# Altium project e-BTW.PrjPcb
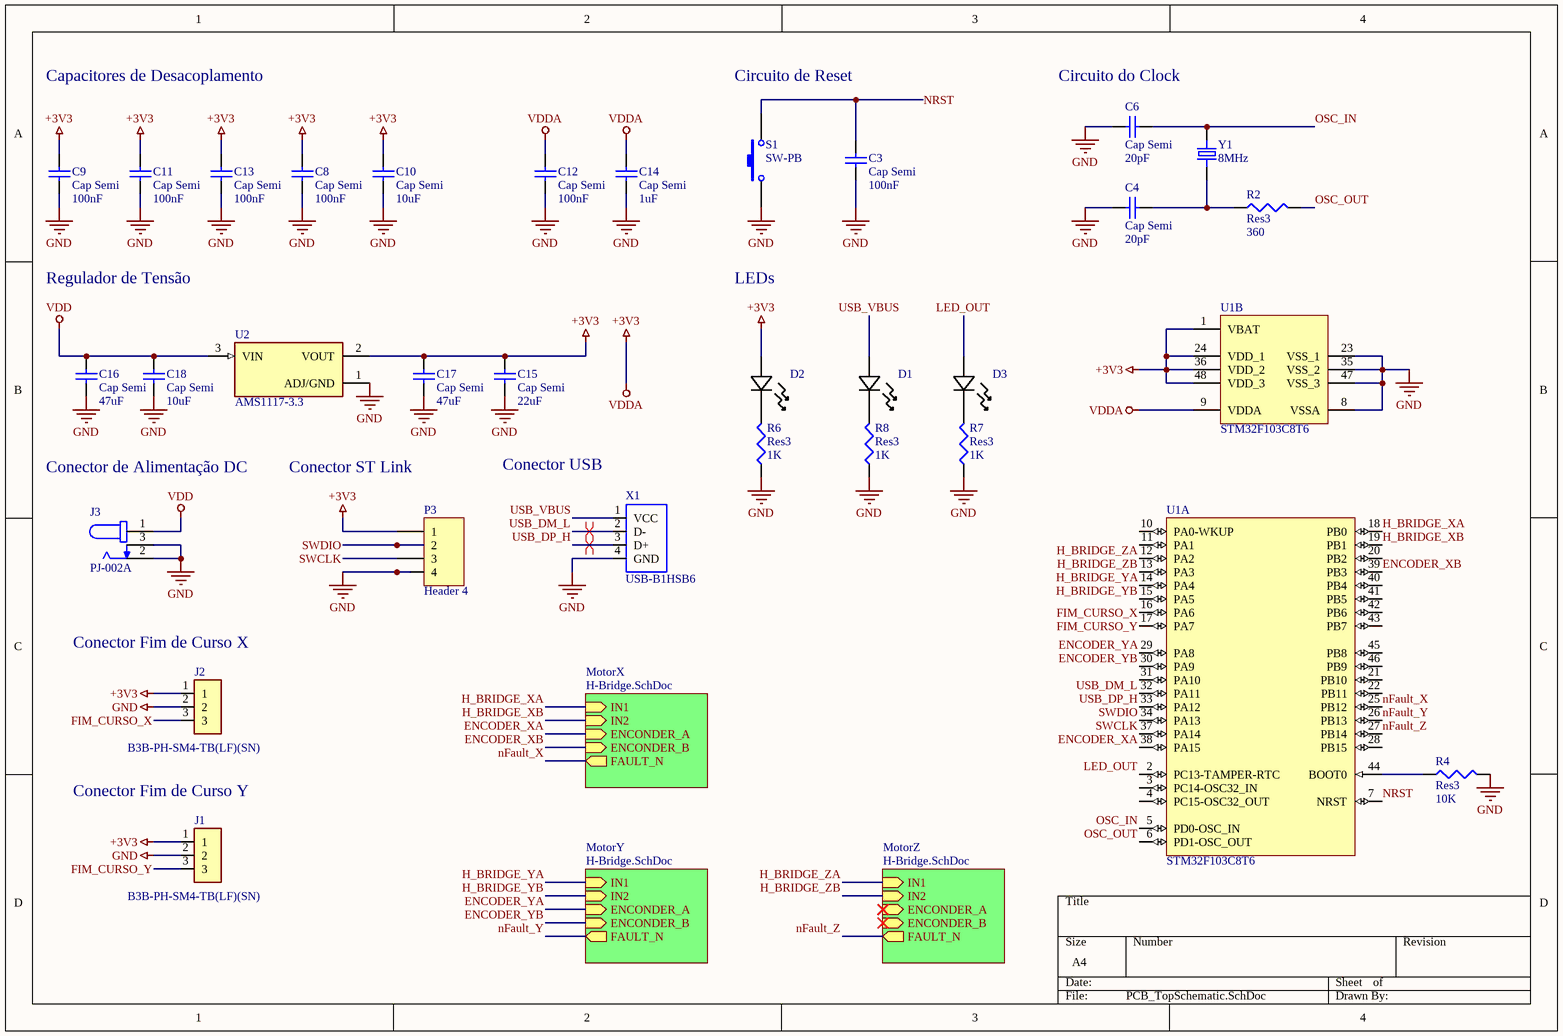
[diagram p0: PCB_TopSchematic.SchDoc]
2 sheets, 46 parts. Net scope: hierarchical (ports join the sheet entries above them; power ports are global).
Board file: PCB1.PcbDoc
Sheets:
  PCB_TopSchematic.SchDoc
    MotorX = H-Bridge.SchDoc
    MotorY = H-Bridge.SchDoc
    MotorZ = H-Bridge.SchDoc

## Sheet PCB_TopSchematic.SchDoc
size A4

### Parts
C3  Cap Semi  value 100nF  [1608[0603]]
C4  Cap Semi  value 20pF  [1608[0603]]
C6  Cap Semi  value 20pF  [1608[0603]]
C8  Cap Semi  value 100nF  [1608[0603]]
C9  Cap Semi  value 100nF  [1608[0603]]
C10  Cap Semi  value 10uF  [1608[0603]]
C11  Cap Semi  value 100nF  [1608[0603]]
C12  Cap Semi  value 100nF  [1608[0603]]
C13  Cap Semi  value 100nF  [1608[0603]]
C14  Cap Semi  value 1uF  [1608[0603]]
C15  Cap Semi  value 22uF  [1608[0603]]
C16  Cap Semi  value 47uF  [1608[0603]]
C17  Cap Semi  value 47uF  [1608[0603]]
C18  Cap Semi  value 10uF  [1608[0603]]
D1  SML-E12M8WT86  [LED_SMLD12_ROM]  (value not drawn)
D2  SML-E12M8WT86  [LED_SMLD12_ROM]  (value not drawn)
D3  SML-E12M8WT86  [LED_SMLD12_ROM]  (value not drawn)
J1  B3B-PH-SM4-TB(LF)(SN)  [JST_B3B-PH-SM4-TB(LF)(SN)]
J2  B3B-PH-SM4-TB(LF)(SN)  [JST_B3B-PH-SM4-TB(LF)(SN)]
J3  PJ-002A  [CUI_PJ-002A]
P3  Header 4  [HDR1X4]
R2  Res3  value 360  [RESC1607X60N]
R4  Res3  value 10K  [RESC1607X60N]
R6  Res3  value 1K  [RESC1607X60N]
R7  Res3  value 1K  [RESC1607X60N]
R8  Res3  value 1K  [RESC1607X60N]
S1  SW-PB  [SW_B3FS-1010P]
U1  STM32F103C8T6  [STM-LQFP48_N]  (parts A,B of 2)
U2  AMS1117-3.3  [SOT229P700X180-4N]
X1  USB-B1HSB6  [OST_USB-B1HSB6]
Y1  8MHz  [XTAL_ECS-80-20-5PX-TR]

### Sub-sheets
MotorX = H-Bridge.SchDoc: IN1 (in), IN2 (in), FAULT_N (out), ENCONDER_A (in), ENCONDER_B (in)
MotorY = H-Bridge.SchDoc: IN1 (in), IN2 (in), FAULT_N (out), ENCONDER_A (in), ENCONDER_B (in)
MotorZ = H-Bridge.SchDoc: IN1 (in), IN2 (in), FAULT_N (out), ENCONDER_A (in), ENCONDER_B (in)

### Nets
+3V3: C8.2 C9.2 C10.2 C11.2 C12.2 C13.2 C14.2 C15.2 C17.2 D2.2 J1.1 J2.1 P3.1 U1.1(VBAT) U1.9(VDDA) U1.24(VDD_1) U1.36(VDD_2) U1.48(VDD_3) U2.2(VOUT)  [also labelled VDDA]
GND: C3.1 C4.2 C6.2 C8.1 C9.1 C10.1 C11.1 C12.1 C13.1 C14.1 C15.1 C16.1 C17.1 C18.1 J1.2 J2.2 J3.2 J3.3 P3.4 R4.2 R6.1 R7.1 R8.1 S1.1 U1.8(VSSA) U1.23(VSS_1) U1.35(VSS_2) U1.47(VSS_3) U2.1(ADJ/GND) X1.4(GND)
VDD: C16.2 C18.2 J3.1 U2.3(VIN)
ENCODER_XA: U1.38(PA15) ; sheet MotorX/ENCONDER_A
ENCODER_XB: U1.39(PB3) ; sheet MotorX/ENCONDER_B
ENCODER_YA: U1.29(PA8) ; sheet MotorY/ENCONDER_A
ENCODER_YB: U1.30(PA9) ; sheet MotorY/ENCONDER_B
FIM_CURSO_X: J2.3 U1.16(PA6)
FIM_CURSO_Y: J1.3 U1.17(PA7)
H_BRIDGE_XA: U1.18(PB0) ; sheet MotorX/IN1
H_BRIDGE_XB: U1.19(PB1) ; sheet MotorX/IN2
H_BRIDGE_YA: U1.14(PA4) ; sheet MotorY/IN1
H_BRIDGE_YB: U1.15(PA5) ; sheet MotorY/IN2
H_BRIDGE_ZA: U1.12(PA2) ; sheet MotorZ/IN1
H_BRIDGE_ZB: U1.13(PA3) ; sheet MotorZ/IN2
LED_OUT: D3.2 U1.2(PC13-TAMPER-RTC)
nFault_X: U1.25(PB12) ; sheet MotorX/FAULT_N
nFault_Y: U1.26(PB13) ; sheet MotorY/FAULT_N
nFault_Z: U1.27(PB14) ; sheet MotorZ/FAULT_N
NRST: C3.2 S1.2 U1.7(NRST)
OSC_IN: C6.1 U1.5(PD0-OSC_IN) Y1.1
OSC_OUT: R2.2 U1.6(PD1-OSC_OUT)
SWCLK: P3.3 U1.37(PA14)
SWDIO: P3.2 U1.34(PA13)
USB_DM_L: U1.32(PA11) X1.2(D-)
USB_DP_H: U1.33(PA12) X1.3(D+)
USB_VBUS: D1.2 X1.1(VCC)
NetC4_1: C4.1 R2.1 Y1.2
NetD1_1: D1.1 R8.2
NetD2_1: D2.1 R6.2
NetD3_1: D3.1 R7.2
NetR4_1: R4.1 U1.44(BOOT0)

Not connected (* = marked no-connect by the designer): U1 3(PC14-OSC32_IN) 4(PC15-OSC32_OUT) 10(PA0-WKUP) 11(PA1) 20(PB2) 21(PB10) 22(PB11) 28(PB15) 31(PA10) 40(PB4) 41(PB5) 42(PB6) 43(PB7) 45(PB8) 46(PB9)

### Notes on the sheet
- Capacitores de Desacoplamento
- Circuito de Reset
- Circuito do Clock
- Regulador de Tensão
- LEDs
- Conector de Alimentação DC
- Conector ST Link
- Conector USB
- (near J2) Conector Fim de Curso X
- Conector Fim de Curso Y

### Library data of the parts
C3 C4 C6 C8-C18 = Cap Semi: Capacitor (Semiconductor SIM Model); Published: 8-Jun-2000; LatestRevisionDate: 29-May-2009; LatestRevisionNote: IPC-7351 Footprint Added.; PackageReference: C1206; Publisher: Altium Limited; PackageDescription: Chip Capacitor
D1-D3 = SML-E12M8WT86: No Description Available; Vendor: ROHM Semiconductor; Built_By: EMA_Matt; SourceLibrary: Rohm_2019-09-23; Type: DEV; Manufacturer_Part_Number: SML-E12M8WT86; Copyright: Copyright (C) 2018 Accelerated Designs. All rights reserved; RefDes: RefDes
J1 J2 = B3B-PH-SM4-TB(LF)(SN): Connector Header Surface Mount 3 position 0.079 _2.00mm_; MF: JST Sales; MP: B3B-PH-SM4-TB_LF__SN_; Digi-Key_Part_Number: 455-1735-1-ND; Digi-Key_Purchase_URL: https://www.digikey.com/product-detail/en/jst-sales-america-inc/B3B-PH-SM4-TB_LF__SN_/455-1735-1-ND/926832?utm_source=snapeda&utm_medium=aggregator&utm_campaign=symbol; Value: *; SnapEDA_Link: https://www.snapeda.com/parts/B3B-PH-SM4-TB%28LF%29%28SN%29/JST%20Sales%20America%20Inc./view-part/53135/?ref=snap; Package: 2010 JST
J3 = PJ-002A: 2,0 x 6,5 mm, 2,5 A, Yatay, AÃ§Ä±k Delik, Dc GÃ¼Ã§ JakÄ± KonnektÃ¶rÃ¼; MF: CUI Devices; Package: None; Price: None; CUI_purchase_URL: https://www.cuidevices.com/product/interconnect/connectors/dc-power-connectors/jacks/pj-002a?utm_source=snapeda.com&utm_medium=referral&utm_campaign=snapedaBOM; SnapEDA_Link: https://www.snapeda.com/parts/PJ-002A/CUI%20Devices/view-part/287588/?ref=snap; Availability: Unavailable; Value: *; MP: PJ-002A
P3 = Header 4: Header, 4-Pin; LatestRevisionDate: 17-Jul-2002; LatestRevisionNote: Re-released for DXP Platform.; Publisher: Altium Limited
R2 R4 R6-R8 = Res3: Resistor; Published: 8-Jun-2000; LatestRevisionDate: 29-May-2009; LatestRevisionNote: IPC-7351 Footprint Added.; PackageReference: J1-0603; Publisher: Altium Limited; PackageDescription: Chip Resistor
S1 = SW-PB: Switch; Published: 24-Mar-1999; LatestRevisionDate: 17-Jul-2002; LatestRevisionNote: Re-released for DXP Platform.; PackageReference: SPST-2; Publisher: Altium Limited; PackageDescription: Switch; 2 Leads
U1 = STM32F103C8T6: ARM Cortex-M3 32-bit MCU, 64 KB Flash, 20 KB Internal RAM, 37 I/Os, 48-pin LQFP, -40 to 85 degC, Tray; A/D Converter: 2x12-bit (10 Channel); FLASH Size (Prog) (kB): 64; I/Os (High Current): 37; Internal RAM Size (kB): 20; Operating Frequency(F) (Processor speed) (MHz): 72; Supply Voltage(Vcc) min (V): 2; DatasheetVersion: Rev. 16; PackageVersion: Rev. 6, 06/2013; PackageReference: LQFP48; PackageDescription: 48-Pin Low Profile Quad Flat Package, 7 x 7 mm Body, 0.5 mm Pitch; Supplier 1: Digi-Key; Supplier Part Number 1: 497-6063-ND; Supplier 2: Farnell; Supplier Part Number 2: 1447637; Supplier 3: Newark; Supplier Part Number 3: 59M2182; Supplier 4: Newark; Supplier Part Number 4: 57P1222; Supplier 5: Mouser; Supplier Part Number 5: 511-STM32F103C8T6; Core: ARM Cortex-M3; Packing: Tray; Mounting Technology: Surface Mount; PartNumber: STM32F103C8T6; ComponentLink1Description: Manufacturer URL; ComponentLink1URL: http://www.st.com/web/en/home.html; ComponentLink2Description: Datasheet; ComponentLink2URL: http://www.st.com/st-web-ui/static/active/en/resource/technical/document/datasheet/CD00161566.pdf; ComponentLink3Description: Package Specification; ComponentLink3URL: http://www.st.com/st-web-ui/static/active/en/resource/technical/document/datasheet/DM00058181.pdf
U2 = AMS1117-3.3: Sot223/Pkg 1-Amp 3.3-Volt Low Drop Out Voltage Regulatator; MF: Advanced Monolithic Systems; Price: None; Package: None; Value: *; MP: AMS1117-3.3; Availability: Unavailable; SnapEDA_Link: https://www.snapeda.com/parts/AMS1117-3.3/Advanced%20Monolithic%20Systems/view-part/53450/?ref=snap
X1 = USB-B1HSB6: USB-B _USB TYPE-B_ Receptacle Connector 4 Position Through Hole, Right Angle; MF: On Shore; Value: *; SnapEDA_Link: https://www.snapeda.com/parts/USB-B1HSB6/On%20Shore%20Technology%20Inc./view-part/227661/?ref=snap; Digi-Key_Purchase_URL: https://www.digikey.com/product-detail/en/on-shore-technology-inc/USB-B1HSB6/ED2983-ND/2677744?utm_source=snapeda&utm_medium=aggregator&utm_campaign=symbol; MP: USB-B1HSB6; Digi-Key_Part_Number: ED2983-ND; Package: None
Y1 = ECS-80-20-5PX-TR: 8MHz Â±30ppm Crystal 20pF 60 Ohms HC-49/US; MF: ECS Inc.; Package: HC-49/US ECS International; MP: ECS-80-20-5PX-TR; Value: *; SnapEDA_Link: https://www.snapeda.com/parts/ECS-80-20-5PX-TR/ECS%20Inc./view-part/2460571/?ref=snap; Digi-Key_Purchase_URL: https://www.digikey.in/product-detail/en/ecs-inc/ECS-80-20-5PX-TR/XC2076CT-ND/5875560?utm_source=snapeda&utm_medium=aggregator&utm_campaign=symbol; Digi-Key_Part_Number: XC2076CT-ND

## Sheet H-Bridge.SchDoc
size A4
Used 3 times, as channels MotorX, MotorY, MotorZ. Parts and nets are listed once, with the designators drawn on the sheet.
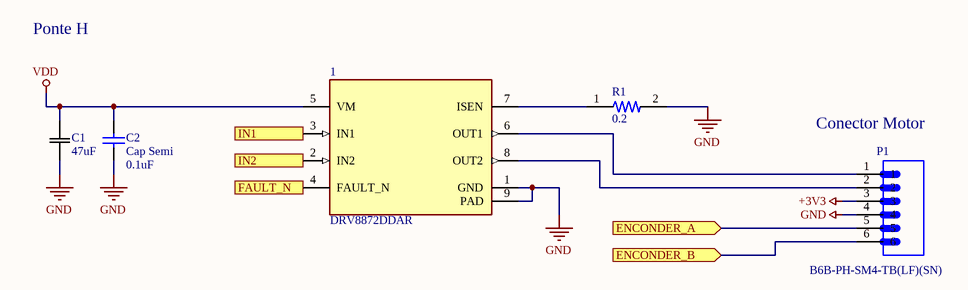
[diagram p1: H-Bridge.SchDoc]

### Parts
1  DRV8872DDAR  [DDA0008H_N]
C1  47uF  [CAP_UWF_6P3X5P00]
C2  Cap Semi  value 0.1uF  [1608[0603]]
P1  B6B-PH-SM4-TB(LF)(SN)  [JST_B6B-PH-SM4-TB(LF)(SN)]
R1  0.2  [RESC1607X60N]

### Ports
ENCONDER_A (in), ENCONDER_B (in), FAULT_N (out), IN1 (in), IN2 (in)

### Nets
+3V3: P1.3
GND: 1.1(GND) 1.9(PAD) C1.1 C2.1 P1.4 R1.2
VDD: 1.5(VM) C1.2 C2.2
ENCONDER_A: P1.5 ; port ENCONDER_A
ENCONDER_B: P1.6 ; port ENCONDER_B
FAULT_N: 1.4(FAULT_N) ; port FAULT_N
IN1: 1.3(IN1) ; port IN1
IN2: 1.2(IN2) ; port IN2
Net1_6: 1.6(OUT1) P1.1
Net1_7: 1.7(ISEN) R1.1
Net1_8: 1.8(OUT2) P1.2

### Channels
MotorX: designators end in _1; ports ENCONDER_A=ENCODER_XA ENCONDER_B=ENCODER_XB FAULT_N=nFault_X IN1=H_BRIDGE_XA IN2=H_BRIDGE_XB
MotorY: designators end in _2; ports ENCONDER_A=ENCODER_YA ENCONDER_B=ENCODER_YB FAULT_N=nFault_Y IN1=H_BRIDGE_YA IN2=H_BRIDGE_YB
MotorZ: designators end in _3; ports ENCONDER_A=NetP1_3_5 ENCONDER_B=NetP1_3_6 FAULT_N=nFault_Z IN1=H_BRIDGE_ZA IN2=H_BRIDGE_ZB

### Notes on the sheet
- Ponte H
- (near P1) Conector Motor

### Library data of the parts
1 = DRV8872DDAR: Unipolar Motor Driver NMOS PWM 8-SO PowerPad; MF: Texas Instruments; Price: None; Package: SO-8 Texas Instruments; MP: DRV8872DDAR; Value: *; Availability: Unavailable; SnapEDA_Link: https://www.snapeda.com/parts/DRV8872DDAR/Texas%20Instruments/view-part/561864/?ref=snap
C1 = UWR1E470MCL1GB: No Description Available; Vendor: Nichicon; Built_By: EMA_Cory; SourceLibrary: Nichicon_2019-09-13; Type: DEV; Manufacturer_Part_Number: UWR1E470MCL1GB; Copyright: Copyright (C) 2018 Accelerated Designs. All rights reserved; RefDes: RefDes
C2 = Cap Semi: Capacitor (Semiconductor SIM Model); Published: 8-Jun-2000; LatestRevisionDate: 29-May-2009; LatestRevisionNote: IPC-7351 Footprint Added.; PackageReference: C1206; Publisher: Altium Limited; PackageDescription: Chip Capacitor
P1 = B6B-PH-SM4-TB(LF)(SN): Connector Header Surface Mount 6 position 0.079 _2.00mm_; MF: JST Sales; MP: B6B-PH-SM4-TB_LF__SN_; Value: *; Price: None; Package: None; SnapEDA_Link: https://www.snapeda.com/parts/B6B-PH-SM4-TB%28LF%29%28SN%29/JST%20Sales%20America%20Inc./view-part/52131/?ref=snap; Availability: Unavailable
R1 = RC0603JR-071KL: 1 kOhms Â±5% 0.1W, 1/10W Chip Resistor 0603 _1608 Metric_ Moisture Resistant Thick Film; MF: Yageo; Value: *; Package: 0603 Yageo; MP: RC0603JR-071KL; SnapEDA_Link: https://www.snapeda.com/parts/RC0603JR-071KL/Yageo/view-part/106141/?ref=snap; Digi-Key_Purchase_URL: https://www.digikey.co.nz/product-detail/en/yageo/RC0603JR-071KL/311-1.0KGRCT-ND/729624?utm_source=snapeda&utm_medium=aggregator&utm_campaign=symbol; Digi-Key_Part_Number: 311-1.0KGRCT-ND

## Nets that join several sheets
+3V3: PCB_TopSchematic (19 pins), MotorX (P1_1.3), MotorY (P1_2.3), MotorZ (P1_3.3)
GND: PCB_TopSchematic (30 pins), MotorX (6 pins), MotorY (6 pins), MotorZ (6 pins)
VDD: PCB_TopSchematic (C16.2 C18.2 J3.1 U2.3), MotorX (1_1.5 C1_1.2 C2_1.2), MotorY (1_2.5 C1_2.2 C2_2.2), MotorZ (1_3.5 C1_3.2 C2_3.2)
ENCODER_XA: PCB_TopSchematic (U1.38), MotorX (P1_1.5)
ENCODER_XB: PCB_TopSchematic (U1.39), MotorX (P1_1.6)
ENCODER_YA: PCB_TopSchematic (U1.29), MotorY (P1_2.5)
ENCODER_YB: PCB_TopSchematic (U1.30), MotorY (P1_2.6)
H_BRIDGE_XA: PCB_TopSchematic (U1.18), MotorX (1_1.3)
H_BRIDGE_XB: PCB_TopSchematic (U1.19), MotorX (1_1.2)
H_BRIDGE_YA: PCB_TopSchematic (U1.14), MotorY (1_2.3)
H_BRIDGE_YB: PCB_TopSchematic (U1.15), MotorY (1_2.2)
H_BRIDGE_ZA: PCB_TopSchematic (U1.12), MotorZ (1_3.3)
H_BRIDGE_ZB: PCB_TopSchematic (U1.13), MotorZ (1_3.2)
nFault_X: PCB_TopSchematic (U1.25), MotorX (1_1.4)
nFault_Y: PCB_TopSchematic (U1.26), MotorY (1_2.4)
nFault_Z: PCB_TopSchematic (U1.27), MotorZ (1_3.4)